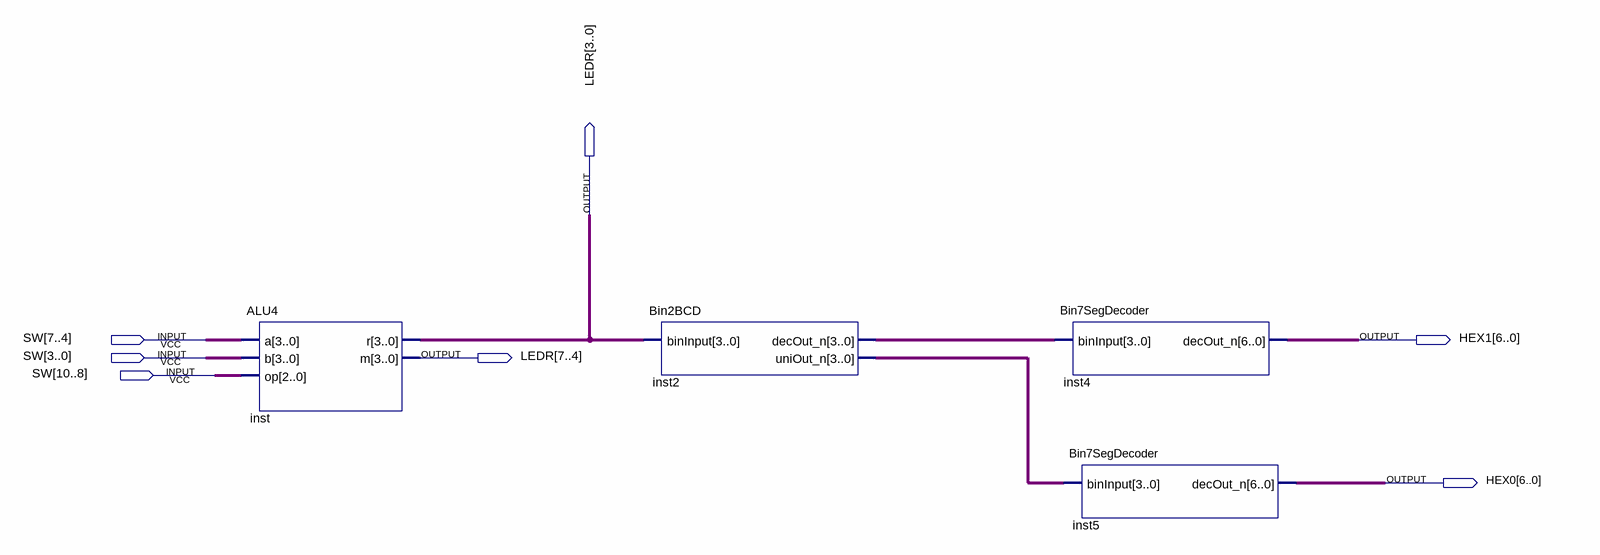
[diagram p0: schematic sheet]
// Quartus schematic FINAL.bdf as structural Verilog: 4 symbols, 7 pins
module FINAL (
  input  [10:0] SW,
  output [7:0] LEDR,
  output [6:0] HEX1,
  output [6:0] HEX0
);

  wire [3:0] inst2_decout_n, inst2_uniout_n;

  ALU4 inst (.a(SW[7:4]), .b(SW[3:0]), .op(SW[10:8]), .r(LEDR[3:0]), .m(LEDR[7:4]));
  Bin2BCD inst2 (.binInput(LEDR[3:0]), .decOut_n(inst2_decout_n), .uniOut_n(inst2_uniout_n));
  Bin7SegDecoder inst4 (.binInput(inst2_decout_n), .decOut_n(HEX1));
  Bin7SegDecoder inst5 (.binInput(inst2_uniout_n), .decOut_n(HEX0));
endmodule
